# EAGLE design RF_Test (EAGLE 9.6.2)
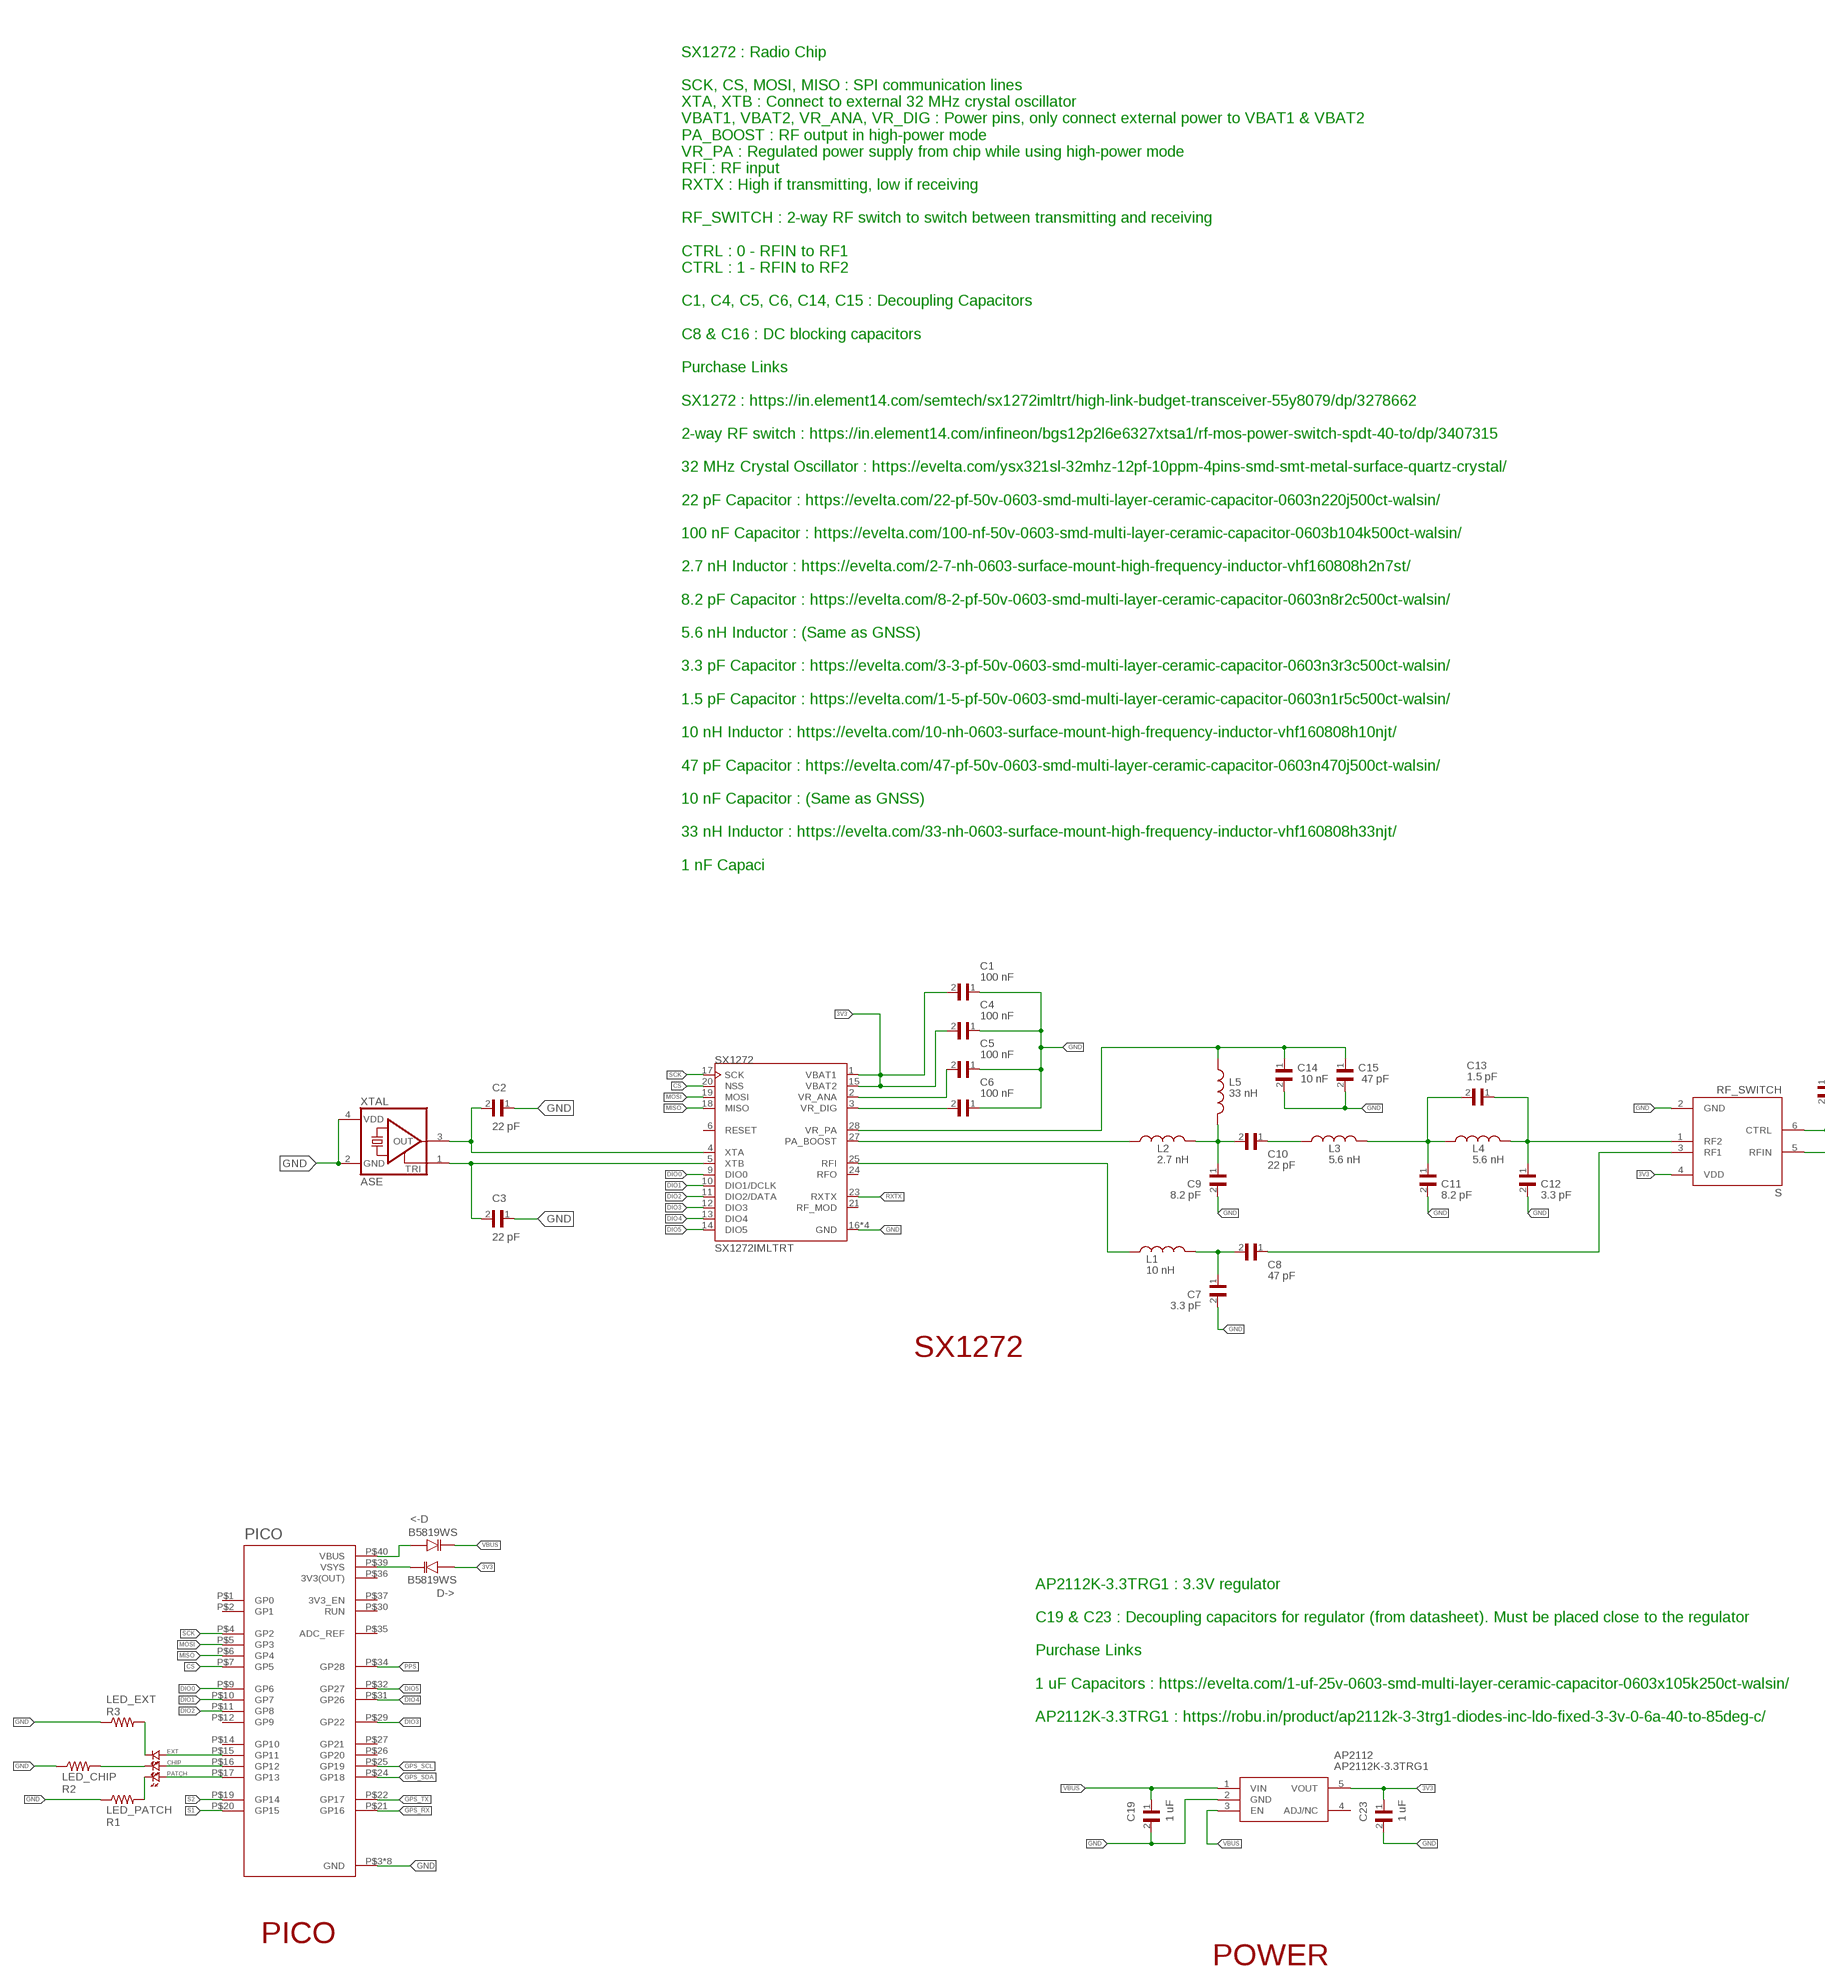
[diagram p0: schematic, sheet 1, part 1 of 2]
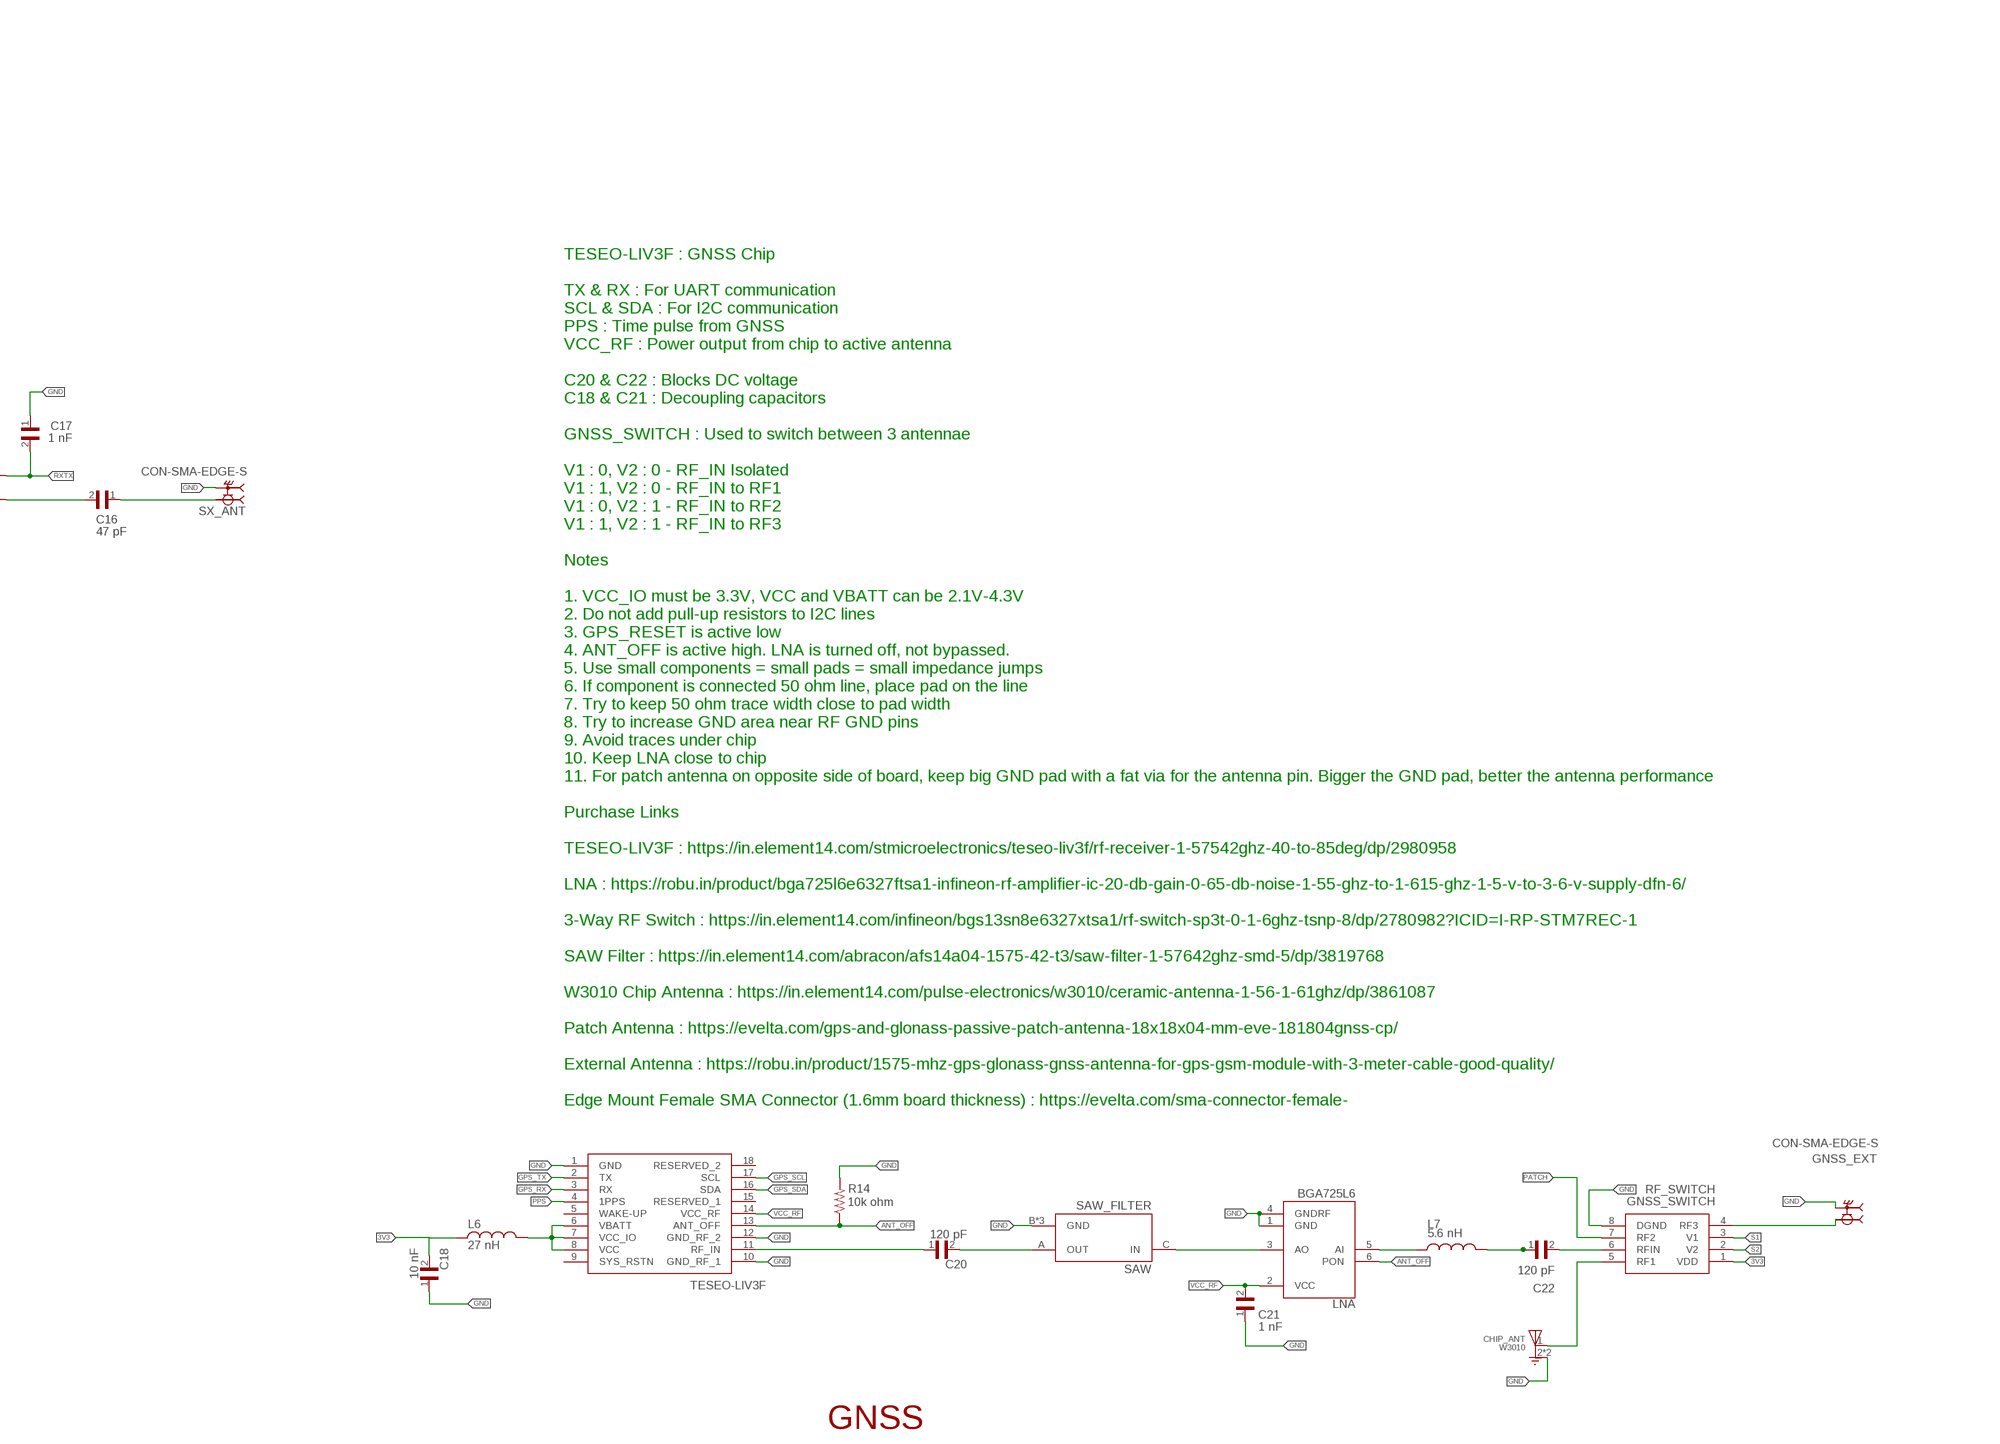
[diagram p1: schematic, sheet 1, part 2 of 2]

## Parts
<-D  B5819WS  ZMV829BTA  [SOD2512X116N]
AP2112  AP2112K-3.3TRG1  [SOT95P282X130-5N]
C1  100 nF  CC0603KRX7R9BB104  [CAPC1608X90]
C2  22 pF  CC0603KRX7R9BB104  [CAPC1608X90]
C3  22 pF  CC0603KRX7R9BB104  [CAPC1608X90]
C4  100 nF  CC0603KRX7R9BB104  [CAPC1608X90]
C5  100 nF  CC0603KRX7R9BB104  [CAPC1608X90]
C6  100 nF  CC0603KRX7R9BB104  [CAPC1608X90]
C7  3.3 pF  CC0603KRX7R9BB104  [CAPC1608X90]
C8  47 pF  CC0603KRX7R9BB104  [CAPC1608X90]
C9  8.2 pF  CC0603KRX7R9BB104  [CAPC1608X90]
C10  22 pF  CC0603KRX7R9BB104  [CAPC1608X90]
C11  8.2 pF  CC0603KRX7R9BB104  [CAPC1608X90]
C12  3.3 pF  CC0603KRX7R9BB104  [CAPC1608X90]
C13  1.5 pF  CC0603KRX7R9BB104  [CAPC1608X90]
C14  10 nF  CC0603KRX7R9BB104  [CAPC1608X90]
C15  47 pF  CC0603KRX7R9BB104  [CAPC1608X90]
C16  47 pF  CC0603KRX7R9BB104  [CAPC1608X90]
C17  1 nF  CC0603KRX7R9BB104  [CAPC1608X90]
C18  10 nF  CC0603KRX7R9BB104  [CAPC1608X90]
C19  1 uF  CC0603KRX7R9BB104  [CAPC1608X90]
C20  120 pF  CC0603KRX7R9BB104  [CAPC1608X90]
C21  1 nF  CC0603KRX7R9BB104  [CAPC1608X90]
C22  120 pF  CC0603KRX7R9BB104  [CAPC1608X90]
C23  1 uF  CC0603KRX7R9BB104  [CAPC1608X90]
CHIP  LED.0603  [0603.LED]
CHIP_ANT  W3010  [XCVR_W3010]
D->  B5819WS  ZMV829BTA  [SOD2512X116N]
EXT  LED.0603  [0603.LED]
GNSS  TESEO-LIV3F  [SON110P970X1010X230-18N]
GNSS_EXT  CON-SMA-EDGE-S  [RFSOLUTIONS_CON-SMA-EDGE-S]
GNSS_SWITCH  RF_SWITCH  BGS13SN8E6327XTSA1  [BGS13SN8E6327XTSA1]
L1  10 nH  LQM18FN100M00D  [INDC1608X90N]
L2  2.7 nH  LQM18FN100M00D  [INDC1608X90N]
L3  5.6 nH  LQM18FN100M00D  [INDC1608X90N]
L4  5.6 nH  LQM18FN100M00D  [INDC1608X90N]
L5  33 nH  LQM18FN100M00D  [INDC1608X90N]
L6  27 nH  LQM18FN100M00D  [INDC1608X90N]
L7  5.6 nH  LQM18FN100M00D  [INDC1608X90N]
LNA  BGA725L6  BGA725L6E6327FTSA1  [AMP_BGA725L6E6327FTSA1]
PATCH  LED.0603  [0603.LED]
PICO  RASPBERRY_PICO-NO_DEBUG  [PICO-PKG-NO_DEBUG]
R1  LED_PATCH  CPF0603F49K9C1  [RESC1608X50N]
R2  LED_CHIP  CPF0603F49K9C1  [RESC1608X50N]
R3  LED_EXT  CPF0603F49K9C1  [RESC1608X50N]
R14  10k ohm  CPF0603F49K9C1  [RESC1608X50N]
S  RF_SWITCH  BGS12P2L6E6327XTSA1  [SW_BGS12P2L6E6327XTSA1]
SAW  SAW_FILTER  AFS14A04-1575.42-T3  [FIL_AFS14A04-1575.42-T3]
SX1272  SX1272IMLTRT  [QFN65P600X600X100-29N]
SX_ANT  CON-SMA-EDGE-S  [RFSOLUTIONS_CON-SMA-EDGE-S]
XTAL  ASE  [ASE]

## Nets
3V3: AP2112.5(VOUT) C1.2 C4.2 C18.2 C23.1 D->.A GNSS_SWITCH.1(VDD) L6.1 S.4(VDD) SX1272.1(VBAT1) SX1272.15(VBAT2)
ANT_OFF: GNSS.13(ANT_OFF) LNA.6(PON) R14.1
CS: PICO.P$7(GP5) SX1272.20(NSS)
DIO0: PICO.P$9(GP6) SX1272.9(DIO0)
DIO1: PICO.P$10(GP7) SX1272.10(DIO1/DCLK)
DIO2: PICO.P$11(GP8) SX1272.11(DIO2/DATA)
DIO3: PICO.P$29(GP22) SX1272.12(DIO3)
DIO4: PICO.P$31(GP26) SX1272.13(DIO4)
DIO5: PICO.P$32(GP27) SX1272.14(DIO5)
GND: AP2112.2(GND) C1.1 C2.1 C3.1 C4.1 C5.1 C6.1 C7.2 C9.2 C11.2 C12.2 C14.2 C15.2 C17.1 C18.1 C19.2 C21.1 C23.2 CHIP_ANT.2(GND) CHIP_ANT.3(GND) GNSS.1(GND) GNSS.10(GND_RF_1) GNSS.12(GND_RF_2) GNSS_EXT.G1 GNSS_EXT.G2 GNSS_EXT.G3 GNSS_EXT.G4 GNSS_SWITCH.8(DGND) LNA.1(GND) LNA.4(GNDRF) PICO.P$3(GND) PICO.P$8(GND) PICO.P$13(GND) PICO.P$18(GND) PICO.P$23(GND) PICO.P$28(GND) PICO.P$33(GND) PICO.P$38(GND) R1.1 R2.1 R3.1 R14.2 S.2(GND) SAW.B(GND) SAW.D(GND) SAW.E(GND) SX1272.16(GND) SX1272.22(GND) SX1272.26(GND) SX1272.29(GND) SX_ANT.G1 SX_ANT.G2 SX_ANT.G3 SX_ANT.G4 XTAL.2(GND) XTAL.4(VDD)
GPS_RX: GNSS.3(RX) PICO.P$21(GP16)
GPS_SCL: GNSS.17(SCL) PICO.P$25(GP19)
GPS_SDA: GNSS.16(SDA) PICO.P$24(GP18)
GPS_TX: GNSS.2(TX) PICO.P$22(GP17)
MISO: PICO.P$6(GP4) SX1272.18(MISO)
MOSI: PICO.P$5(GP3) SX1272.19(MOSI)
N$1: C22.2 GNSS_SWITCH.6(RFIN)
N$2: PATCH.P$1 PICO.P$17(GP13)
N$3: CHIP_ANT.1(FEEDING) GNSS_SWITCH.5(RF1)
N$4: C5.2 SX1272.2(VR_ANA)
N$5: C6.2 SX1272.3(VR_DIG)
N$6: L1.1 SX1272.25(RFI)
N$7: C7.1 C8.2 L1.2
N$8: C8.1 S.3(RF1)
N$9: L2.1 SX1272.27(PA_BOOST)
N$10: C9.1 C10.2 L2.2 L5.2
N$11: C10.1 L3.1
N$12: C11.1 C13.2 L3.2 L4.1
N$13: C12.1 C13.1 L4.2 S.1(RF2)
N$14: C14.1 C15.1 L5.1 SX1272.28(VR_PA)
N$15: C16.2 S.5(RFIN)
N$16: C16.1 SX_ANT.1
N$17: GNSS.6(VBATT) GNSS.7(VCC_IO) GNSS.8(VCC) L6.2
N$18: C20.2 SAW.A(OUT)
N$19: L7.1 LNA.5(AI)
N$20: C22.1 L7.2
N$21: LNA.3(AO) SAW.C(IN)
N$22: D->.K PICO.P$39(VSYS)
N$23: <-D.A PICO.P$40(VBUS)
N$24: GNSS_EXT.1 GNSS_SWITCH.4(RF3)
N$25: PATCH.P$2 R1.2
N$26: CHIP.P$1 PICO.P$16(GP12)
N$27: CHIP.P$2 R2.2
N$28: EXT.P$1 PICO.P$15(GP11)
N$29: EXT.P$2 R3.2
PATCH: GNSS_SWITCH.7(RF2)
PPS: GNSS.4(1PPS) PICO.P$34(GP28)
RF_IN: C20.1 GNSS.11(RF_IN)
RXTX: C17.2 S.6(CTRL) SX1272.23(RXTX)
S1: GNSS_SWITCH.3(V1) PICO.P$20(GP15)
S2: GNSS_SWITCH.2(V2) PICO.P$19(GP14)
SCK: PICO.P$4(GP2) SX1272.17(SCK)
VBUS: <-D.K AP2112.1(VIN) AP2112.3(EN) C19.1
VCC_RF: C21.2 GNSS.14(VCC_RF) LNA.2(VCC)
XIN: C2.2 SX1272.4(XTA) XTAL.3(OUT)
XOUT: C3.2 SX1272.5(XTB) XTAL.1(TRI)
Unconnected: AP2112.4(ADJ/NC) GNSS.5(WAKE-UP) GNSS.9(SYS_RSTN) GNSS.15(RESERVED_1) GNSS.18(RESERVED_2) PICO.P$1(GP0) PICO.P$2(GP1) PICO.P$12(GP9) PICO.P$14(GP10) PICO.P$26(GP20) PICO.P$27(GP21) PICO.P$30(RUN) PICO.P$35(ADC_REF) PICO.P$37(3V3_EN) SX1272.6(RESET) SX1272.21(RF_MOD) SX1272.24(RFO)

## Notes on the sheet
- SX1272 : Radio Chip
  
  SCK, CS, MOSI, MISO : SPI communication lines
  XTA, XTB : Connect to external 32 MHz crystal oscillator
  VBAT1, VBAT2, VR_ANA, VR_DIG : Power pins, only connect external power to VBAT1 & VBAT2
  PA_BOOST : RF output in high-power mode
  VR_PA : Regulated power supply from chip while using high-power mode
  RFI : RF input
  RXTX : High if transmitting, low if receiving
  
  RF_SWITCH : 2-way RF switch to switch between transmitting and receiving
  
  CTRL : 0 - RFIN to RF1
  CTRL : 1 - RFIN to RF2
  
  C1, C4, C5, C6, C14, C15 : Decoupling Capacitors
  
  C8 & C16 : DC blocking capacitors
  
  Purchase Links
  
  SX1272 : https://in.element14.com/semtech/sx1272imltrt/high-link-budget-transceiver-55y8079/dp/3278662
  
  2-way RF switch : https://in.element14.com/infineon/bgs12p2l6e6327xtsa1/rf-mos-power-switch-spdt-40-to/dp/3407315
  
  32 MHz Crystal Oscillator : https://evelta.com/ysx321sl-32mhz-12pf-10ppm-4pins-smd-smt-metal-surface-quartz-crystal/
  
  22 pF Capacitor : https://evelta.com/22-pf-50v-0603-smd-multi-layer-ceramic-capacitor-0603n220j500ct-walsin/
  
  100 nF Capacitor : https://evelta.com/100-nf-50v-0603-smd-multi-layer-ceramic-capacitor-0603b104k500ct-walsin/
  
  2.7 nH Inductor : https://evelta.com/2-7-nh-0603-surface-mount-high-frequency-inductor-vhf160808h2n7st/
  
  8.2 pF Capacitor : https://evelta.com/8-2-pf-50v-0603-smd-multi-layer-ceramic-capacitor-0603n8r2c500ct-walsin/
  
  5.6 nH Inductor : (Same as GNSS)
  
  3.3 pF Capacitor : https://evelta.com/3-3-pf-50v-0603-smd-multi-layer-ceramic-capacitor-0603n3r3c500ct-walsin/
  
  1.5 pF Capacitor : https://evelta.com/1-5-pf-50v-0603-smd-multi-layer-ceramic-capacitor-0603n1r5c500ct-walsin/
  
  10 nH Inductor : https://evelta.com/10-nh-0603-surface-mount-high-frequency-inductor-vhf160808h10njt/
  
  47 pF Capacitor : https://evelta.com/47-pf-50v-0603-smd-multi-layer-ceramic-capacitor-0603n470j500ct-walsin/
  
  10 nF Capacitor : (Same as GNSS)
  
  33 nH Inductor : https://evelta.com/33-nh-0603-surface-mount-high-frequency-inductor-vhf160808h33njt/
  
  1 nF Capacitor : (Same as GNSS)
  
  Edge Mount Female SMA Connector : (Same as GNSS)
- SX1272
- TESEO-LIV3F : GNSS Chip
  
  TX & RX : For UART communication
  SCL & SDA : For I2C communication
  PPS : Time pulse from GNSS
  VCC_RF : Power output from chip to active antenna
  
  C20 & C22 : Blocks DC voltage
  C18 & C21 : Decoupling capacitors
  
  GNSS_SWITCH : Used to switch between 3 antennae
  
  V1 : 0, V2 : 0 - RF_IN Isolated
  V1 : 1, V2 : 0 - RF_IN to RF1
  V1 : 0, V2 : 1 - RF_IN to RF2
  V1 : 1, V2 : 1 - RF_IN to RF3
  
  Notes
  
  1. VCC_IO must be 3.3V, VCC and VBATT can be 2.1V-4.3V
  2. Do not add pull-up resistors to I2C lines
  3. GPS_RESET is active low
  4. ANT_OFF is active high. LNA is turned off, not bypassed.
  5. Use small components = small pads = small impedance jumps
  6. If component is connected 50 ohm line, place pad on the line
  7. Try to keep 50 ohm trace width close to pad width
  8. Try to increase GND area near RF GND pins
  9. Avoid traces under chip
  10. Keep LNA close to chip
  11. For patch antenna on opposite side of board, keep big GND pad with a fat via for the antenna pin. Bigger the GND pad, better the antenna performance
  
  Purchase Links
  
  TESEO-LIV3F : https://in.element14.com/stmicroelectronics/teseo-liv3f/rf-receiver-1-57542ghz-40-to-85deg/dp/2980958
  
  LNA : https://robu.in/product/bga725l6e6327ftsa1-infineon-rf-amplifier-ic-20-db-gain-0-65-db-noise-1-55-ghz-to-1-615-ghz-1-5-v-to-3-6-v-supply-dfn-6/
  
  3-Way RF Switch : https://in.element14.com/infineon/bgs13sn8e6327xtsa1/rf-switch-sp3t-0-1-6ghz-tsnp-8/dp/2780982?ICID=I-RP-STM7REC-1
  
  SAW Filter : https://in.element14.com/abracon/afs14a04-1575-42-t3/saw-filter-1-57642ghz-smd-5/dp/3819768
  
  W3010 Chip Antenna : https://in.element14.com/pulse-electronics/w3010/ceramic-antenna-1-56-1-61ghz/dp/3861087
  
  Patch Antenna : https://evelta.com/gps-and-glonass-passive-patch-antenna-18x18x04-mm-eve-181804gnss-cp/
  
  External Antenna : https://robu.in/product/1575-mhz-gps-glonass-gnss-antenna-for-gps-gsm-module-with-3-meter-cable-good-quality/
  
  Edge Mount Female SMA Connector (1.6mm board thickness) : https://evelta.com/sma-connector-female-pcb-edge-straight/
  
  10 nF Capacitor : https://evelta.com/10-nf-50v-0603-smd-multi-layer-ceramic-capacitor-0603b103k500ct-walsin/
  
  27 nH Inductor : https://evelta.com/27-nh-0603-surface-mount-high-frequency-inductor-vhf160808h27njt/
  
  10k ohm Resistor : https://evelta.com/10k-1-100mw-0603-chip-resistor/
  
  120 pF Capacitor : https://robu.in/product/mc0603n121j500ct-murata-smd-multilayer-ceramic-capacitor-120-pf-50-v-0603-1608-metric-±-5-c0g-np0-mc/
  
  1 nF Capacitor : https://evelta.com/1-nf-50v-0603-smd-multi-layer-ceramic-capacitor-0603b102k500ct-walsin/
  
  5.6 nH Inductor : https://evelta.com/5-6-nh-0603-surface-mount-high-frequency-inductor-vhf160808h5n6st/
- AP2112K-3.3TRG1 : 3.3V regulator
  
  C19 & C23 : Decoupling capacitors for regulator (from datasheet). Must be placed close to the regulator
  
  Purchase Links
  
  1 uF Capacitors : https://evelta.com/1-uf-25v-0603-smd-multi-layer-ceramic-capacitor-0603x105k250ct-walsin/
  
  AP2112K-3.3TRG1 : https://robu.in/product/ap2112k-3-3trg1-diodes-inc-ldo-fixed-3-3v-0-6a-40-to-85deg-c/
- PICO
- POWER
- GNSS

## Power pins joined to a net without a drawn wire
3V3(OUT): PICO.P$36(3V3(OUT))

## Library data of the parts
<-D D-> = ZMV829BTA:ZMV829BTA: Varactors Single 25V Surface Mount SOD-323 Check availability <https://pricing.snapeda.com/parts/ZMV829BTA/Diodes%20Inc./view-part?ref=eda>; AVAILABILITY: In Stock; CHECK_PRICES: https://www.snapeda.com/parts/ZMV829BTA/Diodes+Inc./view-part/?ref=eda; DESCRIPTION: Varactors Single 25 V Surface Mount SOD-323; MF: Diodes Inc.; MP: ZMV829BTA; PACKAGE: SOD-323 Diodes Inc.; PRICE: None; SNAPEDA_LINK: https://www.snapeda.com/parts/ZMV829BTA/Diodes+Inc./view-part/?ref=snap
AP2112 = AP2112K-3.3TRG1:AP2112K-3.3TRG1: 600mA 3.3V LDO Regulator Enable SOT23-5 DiodesZetex AP2112K-3.3TRG1, LDO Voltage Regulator, 3.3 V +/-1.5%, 2.5 6 Vin, 5-Pin SOT-23 Source: Datasheet <http://uk.rs-online.com/web/p/products/8283509>; ARROW_PART_NUMBER: AP2112K-3.3TRG1; ARROW_PRICE-STOCK: https://www.arrow.com/en/products/ap2112k-3.3trg1/diodes-incorporated; DESCRIPTION: 600mA 3.3V LDO Regulator Enable SOT23-5 DiodesZetex AP2112K-3.3TRG1, LDO Voltage Regulator, 3.3 V +/-1.5%, 2.5 6 Vin, 5-Pin SOT-23; HEIGHT: 1.3mm; MANUFACTURER_NAME: Diodes Inc.; MANUFACTURER_PART_NUMBER: AP2112K-3.3TRG1; MOUSER_PART_NUMBER: 621-AP2112K-3.3TRG1; MOUSER_PRICE-STOCK: https://www.mouser.co.uk/ProductDetail/Diodes-Incorporated/AP2112K-33TRG1?qs=x6A8l6qLYDDPYHosCdzh%2FA%3D%3D
C1-C23 = CC0603KRX7R9BB104:CC0603KRX7R9BB104: CAPACITOR, 0603, 100NF, 50V, X7R; Dielectric Characteristic:X7R; Capacitance:100000pF; Capacitance Tolerance:± 10%; Voltage Rating:50V; Temperature Coefficient:± 15%; Capacitor Case Style:0603; No. of Pins:2; Mounting Type:SMD; Operating Temperature Range:-55°C to +125°C; SVHC:No SVHC; Application:Standard; Capacitor Dielectric Type:Multilayer Ceramic; Case Style:0603; Max Operating Temperature:125°C; Min Temperature Operating:-55°C; Terminal Type:Surface Mount (SMD, SMT); Termination Type:SMD; Tolerance, +:10%; Tolerance, -:10%; Voltage Rating DC:50V Check availability <https://pricing.snapeda.com/parts/CC0603KRX7R9BB104/Yageo/view-part?ref=eda>; AVAILABILITY: In Stock; CHECK_PRICES: https://www.snapeda.com/parts/CC0603KRX7R9BB104/Yageo/view-part/?ref=eda; DESCRIPTION: 0.1 µF ±10% 50V Ceramic Capacitor X7R 0603 (1608 Metric); MF: Yageo; MP: CC0603KRX7R9BB104; PACKAGE: 0603 Yageo; PRICE: None; SNAPEDA_LINK: https://www.snapeda.com/parts/CC0603KRX7R9BB104/Yageo/view-part/?ref=snap
CHIP EXT PATCH = standardparts:LED
CHIP_ANT = W3010:W3010: 1.575GHz GPS Chip RF Antenna 2.8dBi Solder Surface Mount Check availability <https://pricing.snapeda.com/parts/W3010/PulseLarsen%20Antennas/view-part?ref=eda>; AVAILABILITY: Not in stock; CHECK_PRICES: https://www.snapeda.com/parts/W3010/PulseLarsen+Antennas/view-part/?ref=eda; DESCRIPTION: 1.575GHz GPS Chip RF Antenna - 2.8dBi Solder Surface Mount; MF: PulseLarsen Antennas; MP: W3010; PACKAGE: None; PRICE: None; PURCHASE-URL: https://www.snapeda.com/api/url_track_click_mouser/?unipart_id=242644&manufacturer=PulseLarsen Antennas&part_name=W3010&search_term=None; SNAPEDA_LINK: https://www.snapeda.com/parts/W3010/PulseLarsen+Antennas/view-part/?ref=snap
GNSS = TESEO-LIV3F:TESEO-LIV3F: GPS Modules Tiny GNSS module Source: Datasheet <https://componentsearchengine.com/Datasheets/1/TESEO-LIV3F.pdf> Check availability <https://pricing.snapeda.com/parts/TESEO-LIV3F/STMicroelectronics/view-part?ref=eda>; AVAILABILITY: In Stock; CHECK_PRICES: https://www.snapeda.com/parts/TESEO-LIV3F/STMicroelectronics/view-part/?ref=eda; DESCRIPTION: - RF Receiver BeiDou, Galileo, GLONASS, GNSS, GPS 1.575GHz -163dBm Not Included 18-LCC (9.7x10.1); MF: STMicroelectronics; MP: TESEO-LIV3F; PACKAGE: SMD-18 STMicroelectronics; PRICE: None; PURCHASE-URL: https://www.snapeda.com/api/url_track_click_mouser/?unipart_id=1474256&manufacturer=STMicroelectronics&part_name=TESEO-LIV3F&search_term=None; SNAPEDA_LINK: https://www.snapeda.com/parts/TESEO-LIV3F/STMicroelectronics/view-part/?ref=snap
GNSS_EXT SX_ANT = CON-SMA-EDGE-S:CON-SMA-EDGE-S: Check availability <https://pricing.snapeda.com/parts/CON-SMA-EDGE-S/RF%20Solutions/view-part?ref=eda>; AVAILABILITY: In Stock; CHECK_PRICES: https://www.snapeda.com/parts/CON-SMA-EDGE-S/RF+Solutions/view-part/?ref=eda; DESCRIPTION: SMA Connector Jack, Female Socket - Board Edge, End Launch Solder; MF: RF Solutions; MP: CON-SMA-EDGE-S; PACKAGE: None; PRICE: None; PURCHASE-URL: https://www.snapeda.com/api/url_track_click_mouser/?unipart_id=557794&manufacturer=RF Solutions&part_name=CON-SMA-EDGE-S&search_term=None; SNAPEDA_LINK: https://www.snapeda.com/parts/CON-SMA-EDGE-S/RF+Solutions/view-part/?ref=snap
GNSS_SWITCH = BGS13SN8E6327XTSA1:BGS13SN8E6327XTSA1: INFINEON - BGS13SN8E6327XTSA1 - RF SWITCH, SP3T, 0.1-6GHZ, TSNP-8 Source: Datasheet <https://www.infineon.com/dgdl/Infineon-BGS13SN8-DS-v02_02-EN.pdf?fileId=5546d462584d1d4a0158cf52e3ae03a7>; DESCRIPTION: INFINEON - BGS13SN8E6327XTSA1 - RF SWITCH, SP3T, 0.1-6GHZ, TSNP-8; HEIGHT: 0.4mm; MANUFACTURER_NAME: Infineon; MANUFACTURER_PART_NUMBER: BGS13SN8E6327XTSA1
L1-L7 = LQM18FN100M00D:LQM18FN100M00D: Inductor Power Chip Shielded Multi-Layer 10uH 20% 1MHz Ferrite 50mA 1.17Ohm DCR 0603 T/R Check availability <https://pricing.snapeda.com/parts/LQM18FN100M00D/Murata%20Electronics/view-part?ref=eda>; AVAILABILITY: In Stock; CHECK_PRICES: https://www.snapeda.com/parts/LQM18FN100M00D/Murata+Electronics+North+America/view-part/?ref=eda; DESCRIPTION: Inductor with Inductance: 10uH Tol. +/-20%, Package: 0603 (1608); MF: Murata Electronics; MP: LQM18FN100M00D; PACKAGE: 1608 Murata; PRICE: None; PURCHASE-URL: https://www.snapeda.com/api/url_track_click_mouser/?unipart_id=105861&manufacturer=Murata Electronics&part_name=LQM18FN100M00D&search_term=None; SNAPEDA_LINK: https://www.snapeda.com/parts/LQM18FN100M00D/Murata+Electronics+North+America/view-part/?ref=snap
LNA = BGA725L6E6327FTSA1:BGA725L6E6327FTSA1: IC AMP GPS 1.55-1.615GHZ TSLP6-2 Check availability <https://pricing.snapeda.com/parts/BGA725L6E6327FTSA1/Infineon%20Technologies/view-part?ref=eda>; AVAILABILITY: In Stock; CHECK_PRICES: https://www.snapeda.com/parts/BGA725L6E6327FTSA1/Infineon+Technologies/view-part/?ref=eda; DESCRIPTION: The BGA725L6 is a front-end low noise amplifier for Global Navigation Satellite Systems (GNSS) from 1550 MHz to 1615 MHz like GPS, GLONASS, Beidou, Galileo and others.; MF: Infineon Technologies; MP: BGA725L6E6327FTSA1; PACKAGE: XFDFN-6 Infineon Technologies; PRICE: None; PURCHASE-URL: https://www.snapeda.com/api/url_track_click_mouser/?unipart_id=426432&manufacturer=Infineon Technologies&part_name=BGA725L6E6327FTSA1&search_term=None; SNAPEDA_LINK: https://www.snapeda.com/parts/BGA725L6E6327FTSA1/Infineon+Technologies/view-part/?ref=snap
PICO = RpiPico:RASPBERRY_PICO-NO_DEBUG
R1-R3 R14 = CPF0603F49K9C1:CPF0603F49K9C1: CPF 0603 49K9 1% 50PPM 1K RL Check availability <https://pricing.snapeda.com/parts/CPF0603F49K9C1/TE%20Connectivity/view-part?ref=eda>; AVAILABILITY: In Stock; CHECK_PRICES: https://www.snapeda.com/parts/CPF0603F49K9C1/TE+Connectivity/view-part/?ref=eda; COMMENT: 2-1879338-7; DESCRIPTION: Surface Mount Thin Film Resistor, Cpf Series, 49.9 Kohm, 63 Mw, - 1%, 50 V, 0603 [1608 Metric]; EU_ROHS_COMPLIANCE: Compliant; MF: TE Connectivity; MP: CPF0603F49K9C1; PACKAGE: 0603; POWER_RATING: .063 W; PRICE: None; PURCHASE-URL: https://www.snapeda.com/api/url_track_click_mouser/?unipart_id=952882&manufacturer=TE Connectivity&part_name=CPF0603F49K9C1&search_term=None; RESISTANCE: 49.9K; SNAPEDA_LINK: https://www.snapeda.com/parts/CPF0603F49K9C1/TE+Connectivity/view-part/?ref=snap; TOLERANCE: 1%; VOLTAGE_RATING: 50 V
S = BGS12P2L6E6327XTSA1:BGS12P2L6E6327XTSA1: RF Switch IC Check availability <https://pricing.snapeda.com/parts/BGS12P2L6E6327XTSA1/Infineon%20Technologies/view-part?ref=eda>; AVAILABILITY: In Stock; CHECK_PRICES: https://www.snapeda.com/parts/BGS12P2L6E6327XTSA1/Infineon+Technologies/view-part/?ref=eda; DESCRIPTION: RF Switch IC GSM, LTE, W-CDMA SPDT 50Ohm PG-TSLP-6-4; MF: Infineon Technologies; MP: BGS12P2L6E6327XTSA1; PACKAGE: TSNP-6 Infineon Technologies; PRICE: None; PURCHASE-URL: https://www.snapeda.com/api/url_track_click_mouser/?unipart_id=4625084&manufacturer=Infineon Technologies&part_name=BGS12P2L6E6327XTSA1&search_term=None; SNAPEDA_LINK: https://www.snapeda.com/parts/BGS12P2L6E6327XTSA1/Infineon+Technologies/view-part/?ref=snap
SAW = AFS14A04-1575.42-T3:AFS14A04-1575.42-T3; MANUFACTURER: Abracon; MAXIMUM_PACKAGE_HEIGHT: 0.7mm; PARTREV: 04.16.13; SNAPEDA_PN: AFS14A04-1575.42-T3; STANDARD: Manufacturer Recommendations
SX1272 = SX1272IMLTRT:SX1272IMLTRT: SX1272 Series 860-1020 MHz 300 kbps Low Power Long Range Transceiver - QFN-28EP Check availability <https://pricing.snapeda.com/parts/SX1272IMLTRT/Semtech/view-part?ref=eda>; AVAILABILITY: In Stock; CHECK_PRICES: https://www.snapeda.com/parts/SX1272IMLTRT/Semtech+Corporation/view-part/?ref=eda; DESCRIPTION: IC RF TxRx Only 802.15.4 LoRa™ 860MHz ~ 1.02GHz 28-VQFN Exposed Pad; MF: Semtech; MP: SX1272IMLTRT; PACKAGE: VQFN-28 Semtech; PRICE: None; PURCHASE-URL: https://www.snapeda.com/api/url_track_click_mouser/?unipart_id=227639&manufacturer=Semtech&part_name=SX1272IMLTRT&search_term=None; SNAPEDA_LINK: https://www.snapeda.com/parts/SX1272IMLTRT/Semtech+Corporation/view-part/?ref=snap
XTAL = crystal:ASE: 3.3Vdc CMOS SMD CRYSTAL CLOCK OSCILLATOR SOurce: www.abracon.com; OC_FARNELL: unknown; OC_NEWARK: unknown

## Board
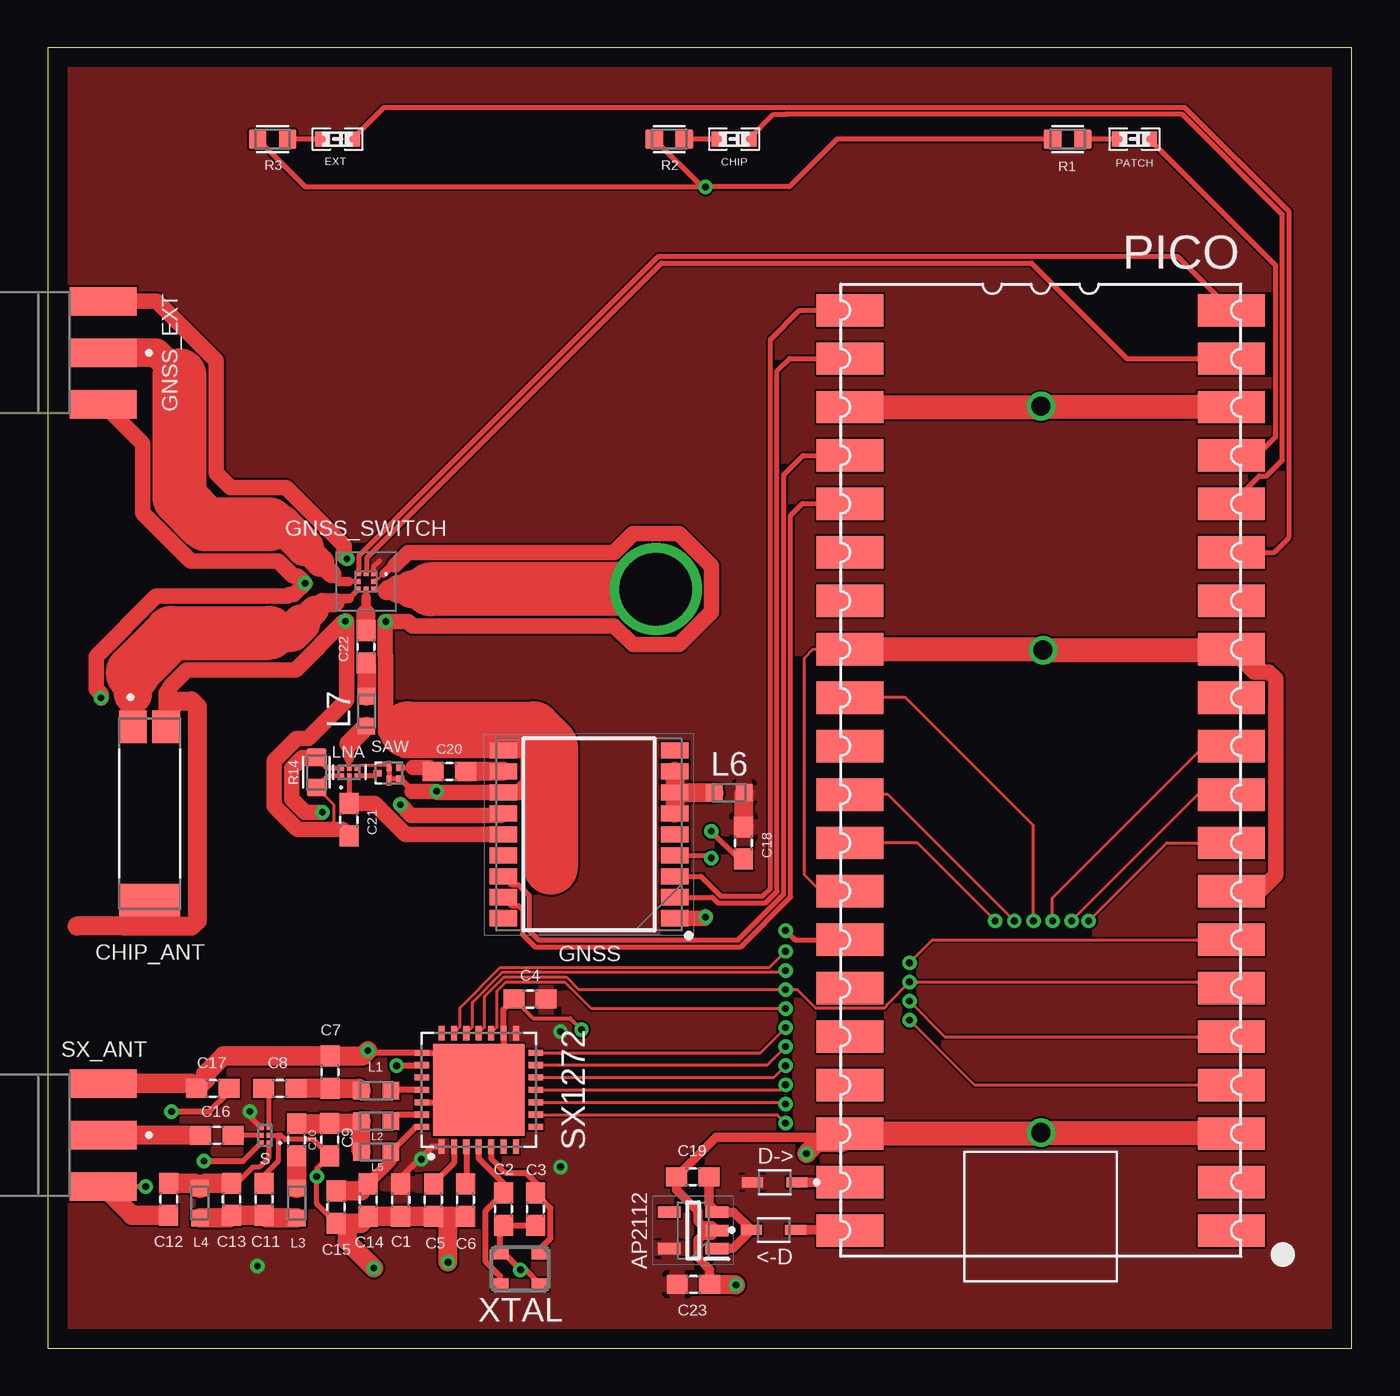
[diagram p2: board, top side]
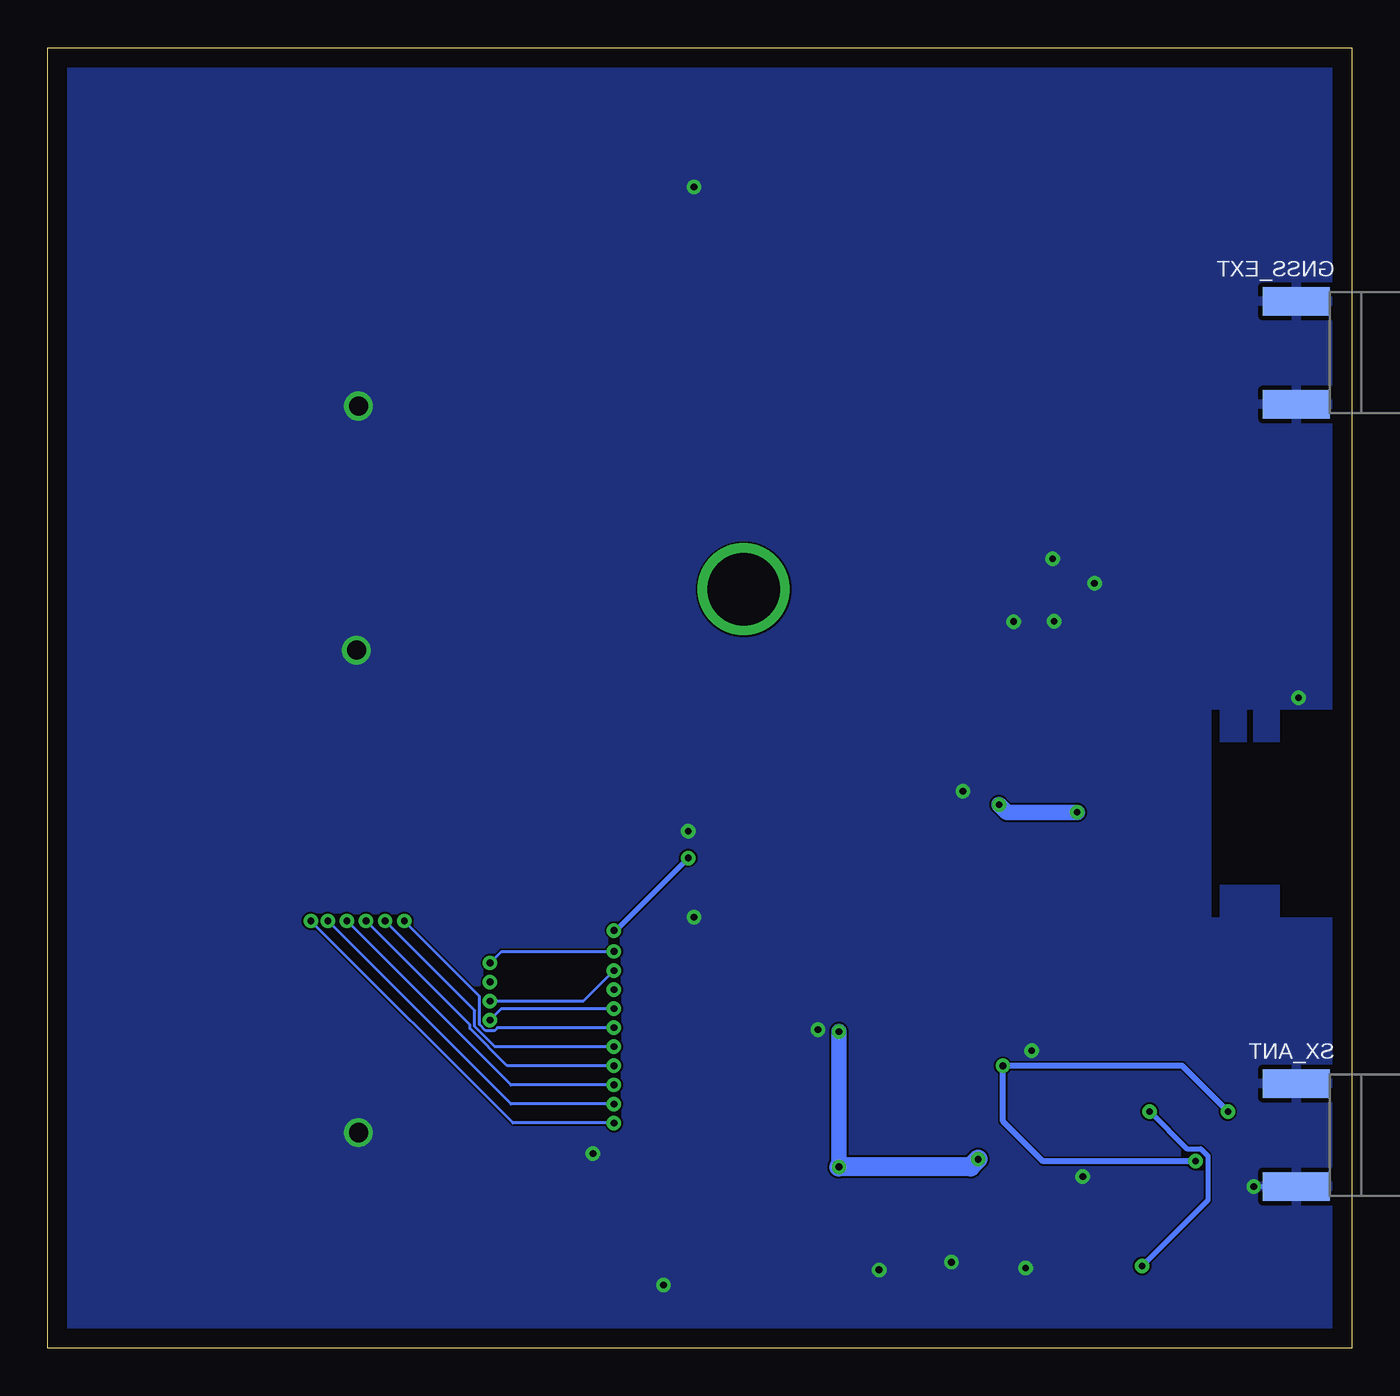
[diagram p3: board, bottom side, seen from below]

Size 68.4 x 68.2 mm. Coordinates in mm from the lower left corner, seen from the top.
Outline: 0,0 68.4,0 68.4,68.2 0,68.2 0,0
Copper layers (1*16): Top 0.035mm / dielectric 1.5mm / Bottom 0.035mm
Design rules "default *": minimum track width 4mil, minimum drill 0.35mm, track to track 4mil, track to pad 4mil, pad to pad 4mil, via to via 4mil, smd to smd 4mil, copper to edge 40mil, drill to drill 6mil, minimum pad ring 10mil, minimum via ring 8mil, stop-mask expansion 4mil, vias tented up to drill 0mil, thermal gap 10mil

### Footprints (pad centres in the part's own frame; a part is rotated, then mirrored left to right if it is on the bottom)
SOD2512X116N = smd 1.11 x 0.52: A 1.165,0; K -1.165,0
SOT95P282X130-5N = smd 1.2 x 0.6: 1 -1.25,0.95; 2 -1.25,0; 3 -1.25,-0.95; 4 1.25,-0.95; 5 1.25,0.95
CAPC1608X90 = smd 1.1 x 1: 1 -0.85,0; 2 0.85,0
0603.LED = smd 0.8 x 0.8: P$1 -0.775,0; P$2 0.775,0
XCVR_W3010 = smd 1.7 x 1.45: 1 4.55,0.875; 2 4.55,-0.875 | smd 1.7 x 3.2: 3 -4.55,0
SON110P970X1010X230-18N = smd 1.45 x 0.85: 1 -4.5,4.4; 2 -4.5,3.3; 3 -4.5,2.2; 4 -4.5,1.1; 5 -4.5,0; 6 -4.5,-1.1; 7 -4.5,-2.2; 8 -4.5,-3.3; 9 -4.5,-4.4; 10 4.5,-4.4; 11 4.5,-3.3; 12 4.5,-2.2; 13 4.5,-1.1; 14 4.5,0; 15 4.5,1.1; 16 4.5,2.2; 17 4.5,3.3; 18 4.5,4.4
RFSOLUTIONS_CON-SMA-EDGE-S = smd 3.5 x 1.5: 1 0,0; G1 0,2.7; G2 0,-2.7 | smd 3.5 x 1.5 bottom: G3 0,2.7; G4 0,-2.7
BGS13SN8E6327XTSA1 = smd 0.25 x 0.25: 1 0.4,-0.4; 2 0.4,0; 3 0.4,0.4; 4 0,0.4; 5 -0.4,0.4; 6 -0.4,0; 7 -0.4,-0.4; 8 0,-0.4
INDC1608X90N = smd 0.87 x 0.93: 1 -0.78,0; 2 0.78,0
AMP_BGA725L6E6327FTSA1 = smd 0.25 x 0.25: 1 -0.2,0.4; 2 -0.2,0; 3 -0.2,-0.4; 4 0.2,-0.4; 5 0.2,0; 6 0.2,0.4
PICO-PKG-NO_DEBUG = smd 3.5 x 1.7: P$1 -8.73,25.4; P$2 -8.73,22.86; P$3 -8.73,20.32; P$4 -8.73,17.78; P$5 -8.73,15.24; P$6 -8.73,12.7; P$7 -8.73,10.16; P$8 -8.73,7.62; P$9 -8.73,5.08; P$10 -8.73,2.54; P$11 -8.73,0; P$12 -8.73,-2.54; P$13 -8.73,-5.08; P$14 -8.73,-7.62; P$15 -8.73,-10.16; P$16 -8.73,-12.7; P$17 -8.73,-15.24; P$18 -8.73,-17.78; P$19 -8.73,-20.32; P$20 -8.73,-22.86; P$21 11.27,-22.86; P$22 11.27,-20.32; P$23 11.27,-17.78; P$24 11.27,-15.24; P$25 11.27,-12.7; P$26 11.27,-10.16; P$27 11.27,-7.62; P$28 11.27,-5.08; P$29 11.27,-2.54; P$30 11.27,0; P$31 11.27,2.54; P$32 11.27,5.08; P$33 11.27,7.62; P$34 11.27,10.16; P$35 11.27,12.7; P$36 11.27,15.24; P$37 11.27,17.78; P$38 11.27,20.32; P$39 11.27,22.86; P$40 11.27,25.4
RESC1608X50N = smd 0.94 x 1.02: 1 -0.79,0; 2 0.79,0
SW_BGS12P2L6E6327XTSA1 = smd 0.25 x 0.25: 1 -0.2,0.4; 2 -0.2,0; 3 -0.2,-0.4; 4 0.2,-0.4; 5 0.2,0; 6 0.2,0.4
FIL_AFS14A04-1575.42-T3 = smd 0.425 x 0.325: A 0.588,0.287; C -0.588,0; E 0.588,-0.287 | smd 0.25 x 0.525: B 0,0.388; D 0,-0.388
QFN65P600X600X100-29N = smd 0.76 x 0.32: 1 -2.98,1.95; 2 -2.98,1.3; 3 -2.98,0.65; 4 -2.98,0; 5 -2.98,-0.65; 6 -2.98,-1.3; 7 -2.98,-1.95; 15 2.98,-1.95; 16 2.98,-1.3; 17 2.98,-0.65; 18 2.98,0; 19 2.98,0.65; 20 2.98,1.3; 21 2.98,1.95 | smd 0.32 x 0.76: 8 -1.95,-2.98; 9 -1.3,-2.98; 10 -0.65,-2.98; 11 0,-2.98; 12 0.65,-2.98; 13 1.3,-2.98; 14 1.95,-2.98; 22 1.95,2.98; 23 1.3,2.98; 24 0.65,2.98; 25 0,2.98; 26 -0.65,2.98; 27 -1.3,2.98; 28 -1.95,2.98 | smd 4.8 x 4.8: 29 0,0
ASE = smd 0.9 x 0.65: 1 -1.05,-0.825; 2 1.05,-0.825; 3 1.05,0.825; 4 -1.05,0.825

### Placement (x,y rotation side)
<-D  38.07,6.19 0 top
AP2112  33.85,6.17 180 top
C1  18.52,7.77 90 top
C2  23.91,7.29 90 top
C3  25.58,7.29 90 top
C4  25.3,18.3 0 top
C5  20.23,7.77 90 top
C6  21.91,7.77 90 top
C7  14.81,14.47 90 top
C8  12.17,13.61 0 top
C9  14.79,10.93 270 top
C10  13.06,10.92 90 top
C11  11.36,7.8 90 top
C12  6.34,7.8 270 top
C13  9.64,7.8 270 top
C14  16.81,7.77 270 top
C15  15.12,7.39 270 top
C16  8.87,11.16 0 top
C17  8.66,13.61 0 top
C18  36.5,26.49 90 top
C19  33.83,8.98 180 top
C20  21.07,30.23 180 top
C21  15.8,27.7 90 top
C22  16.7,36.78 90 top
C23  33.87,3.34 0 top
CHIP  36,63.4 180 top
CHIP_ANT  5.34,28.03 90 top
D->  38.13,8.69 180 top
EXT  15.2,63.4 180 top
GNSS  28.39,26.94 180 top
GNSS_EXT  2.91,52.2 0 top
GNSS_SWITCH  16.7,40.2 90 top
L1  17.23,13.5 180 top
L2  17.23,11.9 180 top
L3  13.07,7.6 270 top
L4  7.99,7.6 90 top
L5  17.23,10.29 180 top
L6  35.75,29.12 180 top
L7  16.72,33.4 90 top
LNA  15.82,30.2 90 top
PATCH  57,63.4 180 top
PICO  53.35,31.57 180 top
R1  53.5,63.4 0 top
R2  32.6,63.4 0 top
R3  11.8,63.4 0 top
R14  14.1,30.19 270 top
S  11.4,11.16 180 top
SAW  17.9,30.15 0 top
SX1272  22.61,13.54 90 top
SX_ANT  2.91,11.17 0 top
XTAL  24.78,4.15 180 top

### Tracks (layer width: path | path; a pad name or v marks a point on that pad's centre or on a via)
3V3  (via drill 0.35)
  Top 0.254: S.4 10.6,12.16 v10.6,12.4 | GNSS_SWITCH.1 17.1,41 17.4,41.3
  Top 0.305: SX1272.1 20.16,10.56 18.52,8.92 C1.2
  Top 1: L6.1 36.53,27.37 C18.2
  Bottom 0.254: v10.6,12.4 8.66,10.46 7.93,10.46 7.54,10.07 7.54,7.76 v11,4.3
  Bottom 0.813: v26.9,9.5 v26.9,16.6
  Bottom 1: v19.6,9.9 20,9.5 v26.9,9.5
  pour Top: -16.9,63.9 -16.9,-4.8 -11.1,-10.6 66.3,-10.6 73.5,-3.4 73.5,58.7 68.9,63.3 68.3,63.9
  pour Top: -15.6,75.5 -15.6,-12.2 -8,-19.8 109,-19.8 111.1,-21.9 111.1,65.4 84.3,92.2 -3.9,92.2 -15.5,80.6 -15.5,75.6
ANT_OFF  (via drill 0.35)
  Top 0.254: LNA.6 14.68,30.4 R14.1
  Top 0.813: GNSS.13 23.79,27.94 19.06,27.94 v18.5,28.5 | R14.1 13.38,30.98 12.8,30.4 12.8,28.8 13.5,28.1 v14.4,28.1
  Bottom 0.813: v18.5,28.5 18.1,28.1 v14.4,28.1
CS  (via drill 0.35)
  Top 0.15: SX1272.20 21.62,16.83 21.62,17.84 23.74,19.96 37.85,19.96 v38.7,20.8 | v45.2,20.2 46.41,21.41 PICO.P$7
  Bottom 0.15: v45.2,20.2 44.6,20.8 v38.7,20.8
DIO0  (via drill 0.35)
  Top 0.15: SX1272.9 38.26,12.24 v38.7,11.8 | v54.6,22.4 58.69,26.49 PICO.P$9
  Bottom 0.15: v38.7,11.8 44,11.8 v54.6,22.4
DIO1  (via drill 0.35)
  Top 0.15: SX1272.10 38.61,12.89 v38.7,12.8 | v53.7,22.4 60.33,29.03 PICO.P$10
  Bottom 0.15: v38.7,12.8 44.1,12.8 v53.7,22.4
DIO2  (via drill 0.35)
  Top 0.15: SX1272.11 38.44,13.54 v38.7,13.8 | v52.7,22.4 52.7,23.6 60.67,31.57 PICO.P$11
  Bottom 0.15: v38.7,13.8 44.1,13.8 v52.7,22.4
DIO3  (via drill 0.35)
  Top 0.15: SX1272.12 38.09,14.19 v38.7,14.8 | v51.7,22.4 51.7,27.4 44.99,34.11 PICO.P$29
  Bottom 0.15: v51.7,22.4 46.26,16.96 46.26,16.76 44.3,14.8 v38.7,14.8
DIO4  (via drill 0.35)
  Top 0.15: SX1272.13 37.74,14.84 v38.7,15.8 | v50.7,22.4 44.07,29.03 PICO.P$31
  Bottom 0.15: v50.7,22.4 49.1,20.8 46.01,17.71 46.01,16.87 44.94,15.8 v38.7,15.8
DIO5  (via drill 0.35)
  Top 0.15: SX1272.14 37.39,15.49 v38.7,16.8 | v49.7,22.4 45.61,26.49 PICO.P$32
  Bottom 0.15: v49.7,22.4 45.75,18.46 45.75,16.97 45.43,16.65 44.97,16.65 44.81,16.8 v38.7,16.8
GND  (via drill 0.35, 1)
  Top 0.15: GNSS_SWITCH.8 17.2,40.3 17.3,40.3 17.6,40.6 | 17.6,40.6 | R14.2 15,28.5 15,27.19 | PICO.P$33 40.55,23.95 39.7,24.8 39.7,36.2 40.15,36.65 PICO.P$28
  Top 0.152: LNA.4 16.39,30.57 17.87,30.57 SAW.B
  Top 0.2: C4.1 25.45,17.3 27.4,17.3 v28,16.7
  Top 0.254: S.2 12.04,11.16 | 12.04,11.16 12.1,11.1 12.1,9.8 11.36,9.06 C11.2 | LNA.1 14.7,30 R14.2 | SAW.B SAW.D 18,29.86 SAW.E | 12.04,11.16 12.22,11.16 12.44,10.94 13.93,10.94 C9.2 14.11,9.4 v14.11,8.99 14.11,7.55 C15.2 | C18.1 36.26,25.64 v34.8,27.1 | SX_ANT.G4 v5.14,8.47 | R1.1 41.4,63.4 38.9,60.9 v34.5,60.9 | v34.5,60.9 34.31,60.9 R2.1 | R3.1 13.51,60.9 v34.5,60.9
  Top 0.305: XTAL.4 25.05,4.1 v24.8,4.1 23.92,4.98 XTAL.2 23.73,6.26 C2.1 C3.1 | SX1272.26 21.96,12.89 SX1272.29 | SX1272.29 20.66,15.49 SX1272.22 16.91,15.49 v16.8,15.6 | SX1272.29 23.91,14.84 SX1272.16 23.91,17.76 C4.1 | SAW.E 19.12,29.23 19.12,29.2
  Top 0.406: 20.3,29.3 v20.4,29.2 | 17.6,40.6 18.06,41.06 18.23,41.06
  Top 0.5: C23.2 34.72,4.13 34.1,4.75 34.1,5.69 34.33,5.92 34.85,5.92 AP2112.2 34.85,6.42 34.33,6.42 34.1,6.65 34.1,7.17 32.98,8.29 C19.2 35.05,11.05 41.88,11.05 PICO.P$38
  Top 0.8: GNSS.10 24.96,31.34 25.2,31.1 25.2,29.62 24.72,29.14 GNSS.12
  Top 0.813: GNSS.1 34.44,22.54 v34.5,22.6 | GNSS.12 20.46,29.14 v20.4,29.2 19.12,29.2 | GNSS.10 20.39,31.34 18.68,31.34 17.73,32.3 | 17.73,32.3 17.73,36.33 17.71,36.35 17.71,38.1 | C21.1 15.46,27.19 15,27.19 13.12,27.19 11.89,28.42 11.89,30.78 13.06,31.96 13.66,31.96 15.68,33.98 15.68,38.05 v15.61,38.12 15.67,38.12 15.69,38.1 15.53,38.1 13.01,35.57 7.3,35.57 6.39,34.67 6.39,34.57 6.21,34.39 CHIP_ANT.2 | v17.73,38.1 18.9,38.1 19.13,37.87 29.7,37.87 30.69,36.88 33.11,36.88 34.82,38.59 34.82,41.01 33.11,42.72 30.69,42.72 29.7,41.73 18.9,41.73 18.23,41.06 | v15.7,41.4 15.56,41.54 15.56,42.08 12.51,45.13 9.6,45.13 8.83,45.9 8.83,51.8 5.73,54.9 GNSS_EXT.G1 | GNSS_EXT.G2 4.97,47.44 4.97,43.8 7.5,41.27 12.1,41.27 12.88,40.49 13.11,40.49 v13.5,40.1 12.91,39.51 12.67,39.51 12.6,39.43 5.7,39.43 2.54,36.26 2.54,34.57 2.8,34.3 v2.8,34.1 | 62.7,36.6 62.65,36.65 PICO.P$13 63.26,35.47 64.04,35.47 64.4,35.11 64.4,24.8 63.55,23.95 PICO.P$8 | 17.73,32.3 18.7,32.3 18.8,32.4
  Top 1: v17.1,4.2 15.7,5.6 15.7,6.54 | v21,4.5 21,6.72 21.2,6.92 | C23.2 36.06,3.34 v36.1,3.3 | v39.8,10.2 40.35,10.75 41.58,10.75 PICO.P$38 | 3.99,22.12 7.55,22.12 7.85,22.42 7.85,33.64 7.55,33.94 6.73,33.94 6.44,33.64 6.44,32.8 CHIP_ANT.2 | CHIP_ANT.3 3.99,22.12 | 3.99,22.12 1.53,22.12 | C7.2 16.52,15.32 v16.8,15.6 | 4.43,6.95 SX_ANT.G4
  Top 1.016: C12.2 4.43,6.95 | C15.2 15.7,6.54 16.43,6.54 C14.2 C1.1 C5.1 21.2,6.92 C6.1 | SX_ANT.G1 7.55,13.87 C17.1 8.3,14.1 8.3,14.38 9.24,15.32 C7.2
  Top 1.27: PICO.P$28 52.15,36.65 v52.2,36.6 62.03,36.6 PICO.P$13 | 62.7,36.6 62.8,36.5 | PICO.P$23 52.05,49.35 | 52.05,49.35 v52.1,49.4 | PICO.P$18 52.05,49.35 | PICO.P$38 52.05,11.25 | 52.05,11.25 v52.1,11.3 | PICO.P$3 52.05,11.25
  Top 2.84: 18.8,32.4 18.9,32.5 25.5,32.5 26.4,31.6 26.4,25.2
  Bottom 0.254: v5.14,8.47 SX_ANT.G4
  pour Bottom: -17.3,64.5 -17.3,-8.9 -18.1,-9.7 46.9,-9.7 52.5,-15.3 80.5,12.7 80.5,25.2 80.5,56.3 66.2,70.6 -11.2,70.6
GPS_RX
  Top 0.254: GNSS.3 34.26,24.74 35.3,23.7 37.5,23.7 37.9,24.1 37.9,52.9 39.43,54.43 PICO.P$21
GPS_SCL
  Top 0.254: GNSS.17 24.34,23.19 24.71,23.19 24.9,23 24.9,21.7 25.56,21.04 36.35,21.04 38.97,23.66 38.97,43.67 39.6,44.3 42.05,44.3 PICO.P$25
GPS_SDA
  Top 0.254: GNSS.16 24.34,24.29 24.71,24.29 25.26,23.75 25.26,21.9 25.76,21.4 36.21,21.4 38.61,23.8 38.61,45.81 39.61,46.81 PICO.P$24
GPS_TX
  Top 0.254: GNSS.2 34.86,23.64 35.15,23.34 37.65,23.34 38.26,23.95 38.26,51.26 38.9,51.9 PICO.P$22
MISO  (via drill 0.35)
  Top 0.15: SX1272.18 22.92,16.83 22.92,18.43 23.95,19.45 27.2,19.45 27.86,18.8 v38.7,18.8 39.3,18.8 40.26,17.84 43.9,17.84 44.01,17.95 44.01,18.01 v45.2,19.2 61.75,19.2 PICO.P$6
MOSI  (via drill 0.35)
  Top 0.15: SX1272.19 22.27,16.83 22.27,18.14 23.84,19.7 38.6,19.7 v38.7,19.8 | v45.2,18.2 47.07,16.33 PICO.P$5
  Bottom 0.15: v45.2,18.2 40.3,18.2 v38.7,19.8
N$1
  Top 0.254: GNSS_SWITCH.6 16.7,39.38 | 16.7,38.5 16.7,38.92
  Top 0.5: 16.7,38.92 16.7,38.93 16.7,39.38
  Top 1: C22.2 16.7,38.5
N$2
  Top 0.254: PICO.P$17 63.41,46.81 64.4,47.8 64.4,56.78 PATCH.P$1
N$3
  Top 0.254: 15.8,39.3 GNSS_SWITCH.5
  Top 0.5: 15.8,39.3 15.3,39.3 15.1,39.1
  Top 1: 14,38.7 14.4,39.1 15.1,39.1
  Top 1.27: CHIP_ANT.1 4.46,34.27
  Top 1.5: 13.3,38 14,38.7
  Top 2: 4.46,34.27 4.46,35.37 | 11.6,37.5 12.8,37.5 13.3,38
  Top 2.84: 4.46,35.37 4.46,35.47 6.5,37.5 11.6,37.5
N$4
  Top 0.305: SX1272.2 21.31,9.71 C5.2
N$5
  Top 0.305: SX1272.3 21.96,8.67 C6.2
N$6
  Top 0.305: SX1272.25 18.05,13.54 L1.1
N$7
  Top 1: C7.1 C8.2 | C7.1 16.33,13.62 L1.2
  Top 1.016: C7.1
N$8
  Top 0.254: S.3 11.6,13.33 C8.1
N$9
  Top 0.305: SX1272.27 18.35,12.24 L2.1
N$10
  Top 1: L5.2 L2.2 16.33,11.78 C9.1
  Top 1.016: C9.1 C10.2
N$11
  Top 1.016: C10.1 L3.1
N$12
  Top 1.016: L3.2 11.49,6.82 C11.1 C13.2 9.51,6.82 L4.1
N$13
  Top 0.254: S.1 11.6,10.3 11.6,10 11.08,9.48 10.74,9.48 9.92,8.65 C13.1
  Top 1.016: C13.1 8.26,8.65 L4.2 7.72,8.65 C12.1
N$14
  Top 0.305: L5.1 19.16,11.44 | 19.16,11.44 19.31,11.59 SX1272.28 | 19.16,11.44
  Top 0.61: C14.1 18.01,9.82 L5.1
  Top 1.016: C14.1 16.43,8.24 C15.1
N$15
  Top 0.254: S.5 C16.2
N$16
  Top 0.813: SX_ANT.1
  Top 1: C16.1 SX_ANT.1
N$17
  Top 1: L6.2 32.91,29.12 | 32.91,29.12 GNSS.7 GNSS.6 | GNSS.8 32.91,30.22 32.91,29.12
N$18
  Top 0.254: SAW.A 19.16,30.44
  Top 0.8: 19.16,30.44 20.01,30.44 C20.2
N$19
  Top 0.254: LNA.5 15.82,30.9 15.8,30.9
  Top 0.5: 15.8,30.9 15.8,31.7
  Top 1: L7.1 15.8,31.7
N$20
  Top 1: C22.1 16.72,35.91 L7.2
N$21
  Top 0.254: LNA.3 17.16,30 SAW.C
N$22
  Top 0.5: D->.K 42.06,8.69 PICO.P$39
N$23
  Top 0.5: <-D.A 42.06,6.19 PICO.P$40
N$24
  Top 0.254: GNSS_SWITCH.4 15.78,40.2
  Top 0.5: 14.9,40.6 15.3,40.2 15.78,40.2
  Top 1: 14.3,41.2 14.9,40.6
  Top 1.5: GNSS_EXT.1 5.7,52.2 6.6,51.3 | 13.5,42 14.3,41.2
  Top 2: 6.6,51.3 6.9,51 | 11.6,43.2 12.3,43.2 13.5,42
  Top 2.84: 6.9,51 6.9,44.6 8.3,43.2 11.6,43.2
N$25
  Top 0.254: PATCH.P$2 R1.2
N$26
  Top 0.254: PICO.P$16 63.54,45.73 63.93,45.73 64.76,46.56 64.76,59.44 59.5,64.7 38.8,64.7 38.7,64.7 38.07,64.7 CHIP.P$1
N$27
  Top 0.254: CHIP.P$2 R2.2
N$28
  Top 0.254: PICO.P$15 64.33,41.73 65.11,42.51 65.11,59.59 59.65,65.06 17.63,65.06 EXT.P$1
N$29
  Top 0.254: EXT.P$2 R3.2
PATCH  (via drill 3.8 pad 3.5)
  Top 0.254: GNSS_SWITCH.7 17.7,39.8 17.79,39.71
  Top 1: 18.4,39.8 17.87,39.8 17.79,39.71
  Top 1.5: 18.4,39.8 19.1,39.8
  Top 2: 20.1,39.8 19.1,39.8
  Top 2.84: v31.9,39.8 20.1,39.8
PPS  (via drill 0.35)
  Top 0.254: GNSS.4 34.66,25.84 v34.8,25.7 | v38.7,21.9 39.19,21.41 PICO.P$34
  Bottom 0.254: v34.8,25.7 38.6,21.9 v38.7,21.9
RF_IN
  Top 1: GNSS.11 C20.1
RXTX  (via drill 0.35)
  Top 0.254: S.6 10.24,9.8
  Top 0.305: SX1272.23 19.59,14.8 v18.3,14.8 | v6.5,12.4 8.5,12.4 9.51,13.41 C17.2 | 10.24,9.8 v8.2,9.8
  Bottom 0.305: v6.5,12.4 8.9,14.8 v18.3,14.8 18.3,11.9 16.2,9.8 v8.2,9.8
S1
  Top 0.254: GNSS_SWITCH.3 16.34,40.64 16.34,41.55 32.05,57.26 59.25,57.26 PICO.P$20
S2
  Top 0.254: GNSS_SWITCH.2 16.74,40.64 16.74,41.45 32.2,56.9 51.6,56.9 56.61,51.89 PICO.P$19
SCK  (via drill 0.35)
  Top 0.15: SX1272.17 23.57,16.83 23.57,18.72 24.05,19.2 27.1,19.2 28.5,17.8 v38.7,17.8 | v45.2,17.2 48.61,13.79 PICO.P$4
  Bottom 0.15: v38.7,17.8 44.6,17.8 v45.2,17.2
VBUS
  Top 0.5: AP2112.1 35.93,5.22 <-D.K 35.98,7.12 AP2112.3 34.68,7.54 C19.1
VCC_RF
  Top 0.254: LNA.2 15.82,28.57 C21.2
  Top 0.813: GNSS.14 18.76,26.94 17.15,28.55 C21.2
XIN
  Top 0.305: XTAL.3 23.73,3.77 22.98,4.52 22.98,7.21 C2.2 23.91,8.64 22.61,9.94 SX1272.4
XOUT
  Top 0.305: XTAL.1 25.83,5.21 26.38,5.76 26.38,7.34 25.81,7.91 | 25.81,7.91 C3.2 | SX1272.5 23.26,9.94 24,9.2 25.1,9.2 25.81,8.49 25.81,7.91